# Altium schematic sheet MCU.SchDoc
size A4
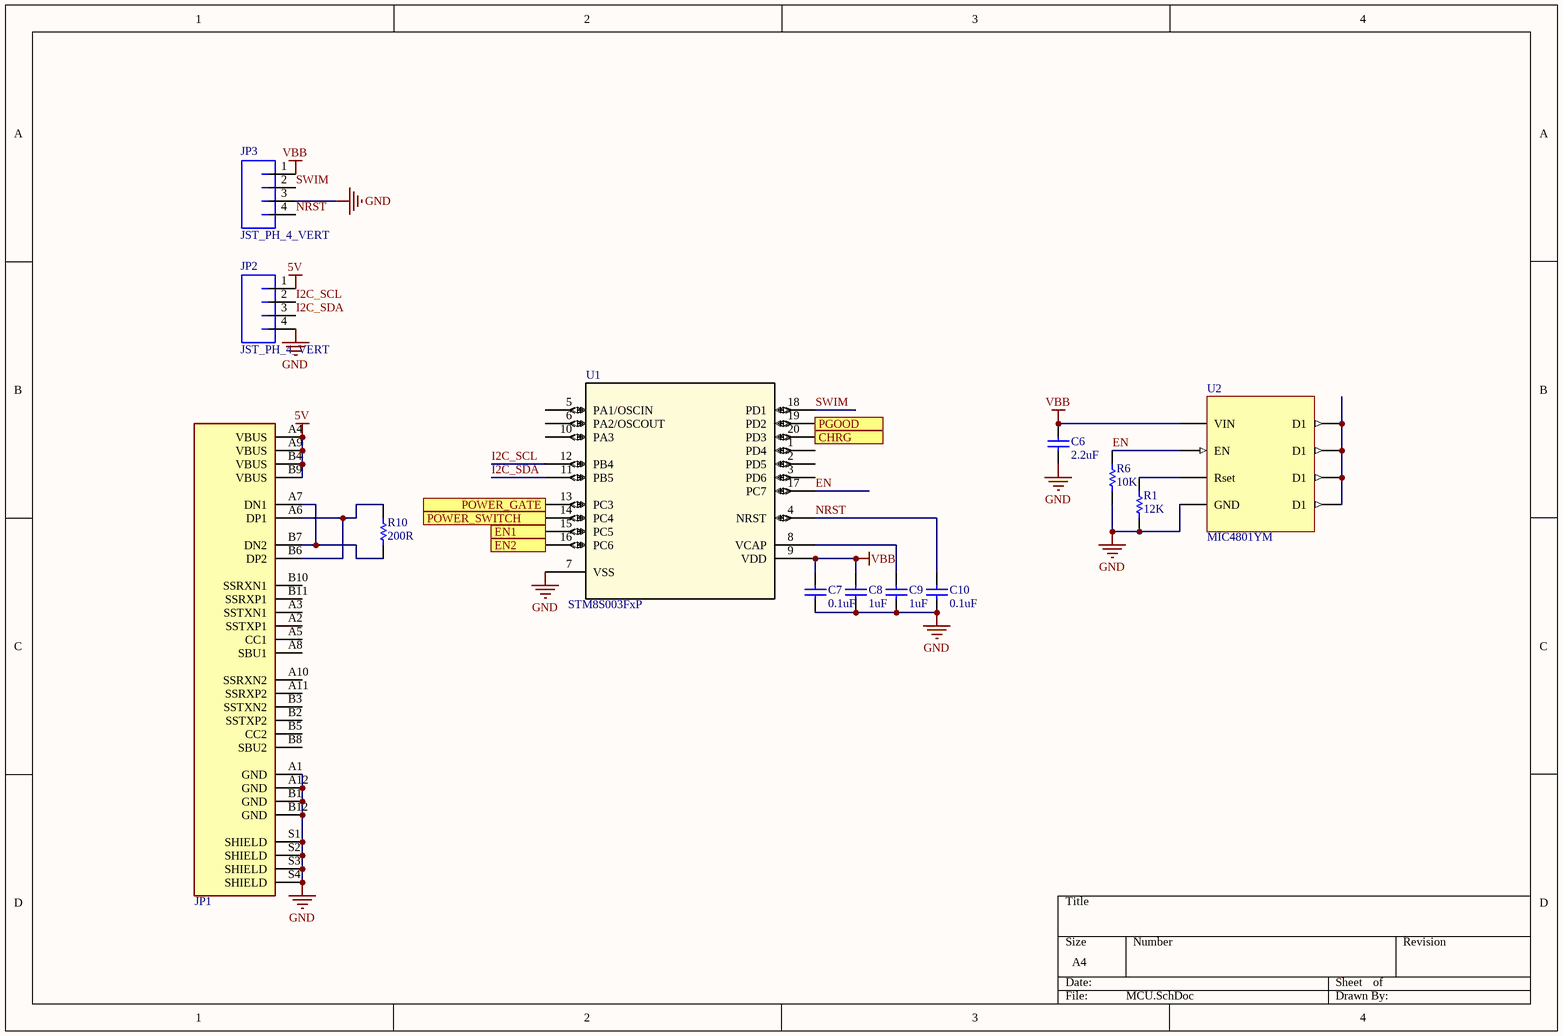
[diagram p0: MCU.SchDoc]

## Parts
C6  value 2.2uF  [C0603[1608X92]]  (hidden comment: 2.2uF 6.3V 0603)
C7  value 0.1uF  [C0603[1608X92]]  (hidden comment: 0.1uF 6.3V 0603)
C8  value 1uF  [C0603[1608X92]]  (hidden comment: 1uF 6.3V 0603)
C9  value 1uF  [C0603[1608X92]]  (hidden comment: 1uF 6.3V 0603)
C10  value 0.1uF  [C0603[1608X92]]  (hidden comment: 0.1uF 6.3V 0603)
JP1  UJ31-CH-3-MSMT-TR-67  [CUI_UJ31-CH-3-MSMT-TR-67]  (value not drawn)
JP2  JST_PH_4_VERT  [JST-PH-4-PTH-VERT]
JP3  JST_PH_4_VERT  [JST-PH-4-PTH-VERT]
R1  value 12K  [R0603[1608]]  (hidden comment: 12K 1% 0603)
R6  value 10K  [R0603[1608]]  (hidden comment: 10K 1% 0603)
R10  value 200R  [R0603[1608]]  (hidden comment: 200R 1% 0603)
U1  STM8S003FxP  [TSSOP-20]
U2  MIC4801YM  [SOIC-8]

## Ports
CHRG (in), EN1 (in), EN2 (in), PGOOD (in), POWER_GATE (out), POWER_SWITCH (in)

## Nets
5V: JP1.A4(VBUS) JP1.A9(VBUS) JP1.B4(VBUS) JP1.B9(VBUS) JP2.1
GND: C6.1 C7.1 C8.2 C9.2 C10.1 JP1.A1(GND) JP1.A12(GND) JP1.B1(GND) JP1.B12(GND) JP1.S1(SHIELD) JP1.S2(SHIELD) JP1.S3(SHIELD) JP1.S4(SHIELD) JP2.4 JP3.3 R1.1 R6.1 U1.7(VSS) U2.4(GND)
VBB: C6.2 C7.2 C8.1 JP3.1 U1.9(VDD) U2.1(VIN)
CHRG: U1.20(PD3) ; port CHRG
EN: R6.2 U1.17(PC7) U2.2(EN)
EN1: U1.15(PC5) ; port EN1
EN2: U1.16(PC6) ; port EN2
I2C_SCL: JP2.2 U1.12(PB4)
I2C_SDA: JP2.3 U1.11(PB5)
NRST: C10.2 JP3.4 U1.4(NRST)
PGOOD: U1.19(PD2) ; port PGOOD
POWER_GATE: U1.13(PC3) ; port POWER_GATE
POWER_SWITCH: U1.14(PC4) ; port POWER_SWITCH
SWIM: JP3.2 U1.18(PD1)
NetC9_1: C9.1 U1.8(VCAP)
NetJP1_A6: JP1.A6(DP1) JP1.B6(DP2) R10.2
NetJP1_A7: JP1.A7(DN1) JP1.B7(DN2) R10.1
NetR1_2: R1.2 U2.3(Rset)
NetU2_5: U2.5(D1) U2.6(D1) U2.7(D1) U2.8(D1)

Not connected (* = marked no-connect by the designer): JP1 A2(SSTXP1) A3(SSTXN1) A5(CC1) A8(SBU1) A10(SSRXN2) A11(SSRXP2) B2(SSTXP2) B3(SSTXN2) B5(CC2) B8(SBU2) B10(SSRXN1) B11(SSRXP1); U1 1(PD4) 2(PD5) 3(PD6) 5(PA1/OSCIN) 6(PA2/OSCOUT) 10(PA3)

## Library data of the parts
C6 = CAP_2.2uF_6.3V_0603_10%: 2.2uF 6.3V 10% 0603 (1608 Metric); PartNumber: GRM185R60J225KE26D; Manufacturer: Murata; TemperatureCoefficient: X5R; Mounting Technology: Surface Mount; PackageReference: 0603; PackageDescription: 0603 (1608 Metric); Voltage: 6.3V; Tolerance: 10%
C7 C10 = CAP_0.1uF_6.3V_0603_10%: 0.1uF 6.3V 10% 0603 (1608 Metric); PartNumber: GRM188R70J104KA01D; Manufacturer: Murata; Mounting Technology: Surface Mount; PackageReference: 0603; PackageDescription: 0603 (1608 Metric); Voltage: 6.3V; Tolerance: 10%
C8 C9 = CAP_1uF_6.3V_0603_10%: 1uF 6.3V 10% 0603 (1608 Metric); PartNumber: GRM188R60J105KA01D; Manufacturer: Murata; TemperatureCoefficient: X5R; Mounting Technology: Surface Mount; PackageReference: 0603; PackageDescription: 0603 (1608 Metric); Voltage: 6.3V; Tolerance: 10%
JP1 = UJ31-CH-3-MSMT-TR-67: Type C, USB 3.1 Gen 2, 5 A, Right Angle, Mid Mount _SMT_,  Waterproof, USB Receptacle; Manufacturer: CUI Devices; Package: Surface Mount, Through Hole; PartNumber: UJ31-CH-3-MSMT-TR
JP2 JP3 = JST_PH_4_VERT: PartNumber: B4B-PH-K-S(LF)(SN); Manufacturer: JST Sales America Inc.; PackageReference: JST-PH; Mounting Technology: Through Hole
R1 = RES_12K_0603_1%: 12K 0.25W 1% 0603 (1005 Metric); Manufacturer: Vishay; PartNumber: RCS060312K0FKEA; Tolerance: 1%; Power: 0.25W; Mounting Technology: Surface Mount; PackageReference: 0603; PackageDescription: 0603 (1608 Metric); ComponentLink1Description: Datasheet; ComponentLink1URL: http://www.vishay.com/docs/20065/rcse3.pdf
R6 = RES_10K_0603_1%: 10K 0.25W 1% 0603 (1005 Metric); Manufacturer: Vishay / Dale; PartNumber: CRCW060310K0FKEAHP; Tolerance: 1%; Power: 0.25W; Mounting Technology: Surface Mount; PackageReference: 0603; PackageDescription: 0603 (1608 Metric); ComponentLink1Description: Datasheet; ComponentLink1URL: http://www.vishay.com/docs/20065/rcse3.pdf
R10 = RES_200R_0603_1%: 200R 0.25W 1% 0603 (1005 Metric); Manufacturer: Vishay / Dale; PartNumber: CRCW0603200RFKEAHP; Tolerance: 1%; Power: 0.25W; Mounting Technology: Surface Mount; PackageReference: 0603; PackageDescription: 0603 (1608 Metric); ComponentLink1Description: Datasheet; ComponentLink1URL: http://www.vishay.com/docs/20043/crcwhpe3.pdf
U1 = STM8S003FxP: 8-bit MCU with 8 Kbytes Flash, 16 MHz CPU, integrated EEPROM; Manufacturer: STMicroelectronics; Part Number: STM8S003FxP; Mounting Technology: Surface Mount; PackageReference: TSSOP-20
U2 = MIC4801: 600mA Single Channel WLED Driver w/ Ultrafast PWM Control; Manufacturer: Microchips; PartNumber: MIC4801YM; Mounting Technology: Surface Mount; PackageReference: SOIC-8